# EasyEDA Pro project picobug.epro, board PCB1
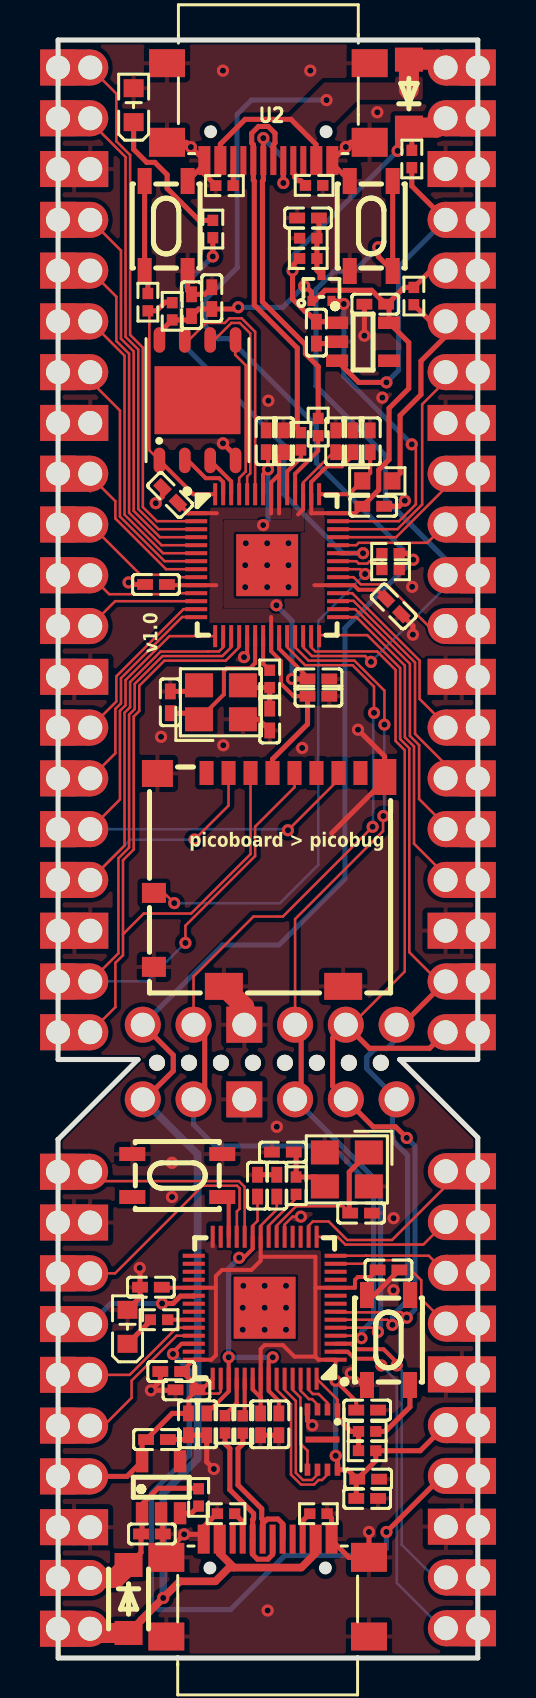
[diagram p1: board, top side]
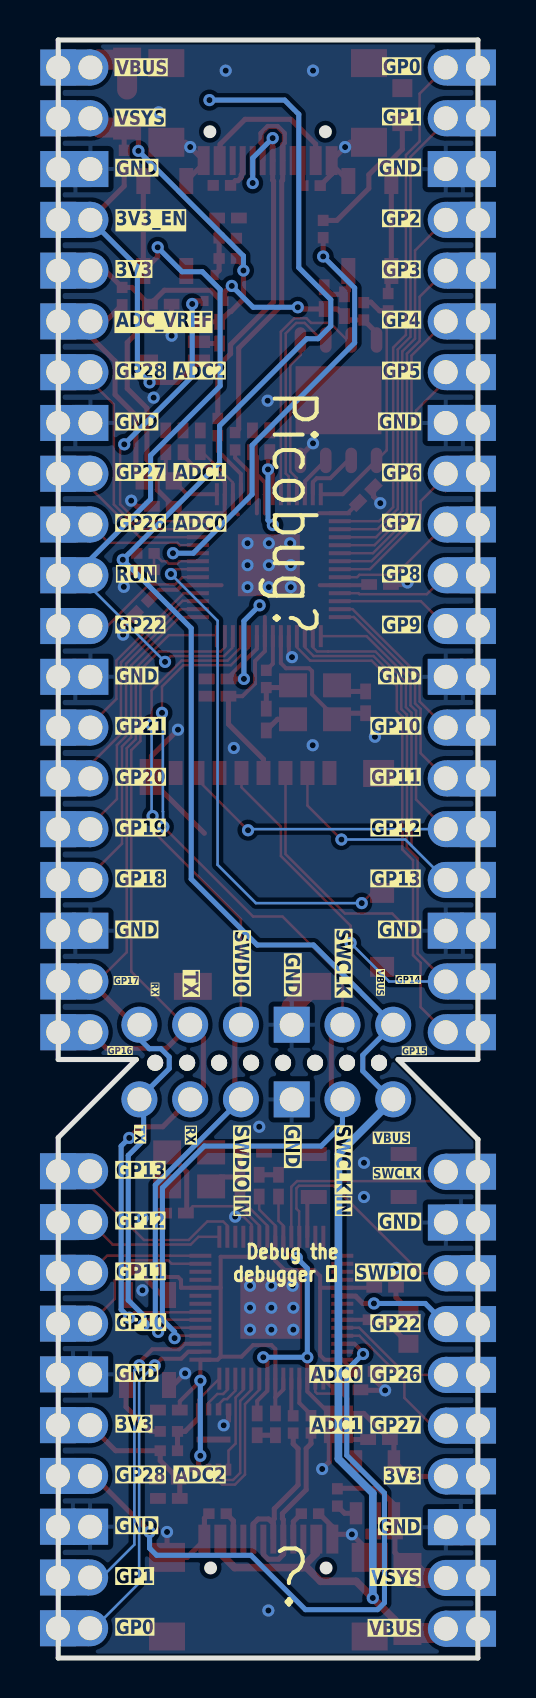
[diagram p2: board, bottom side, seen from below]

Outline 21 x 80.94 mm; copper layers: Top Layer, Bottom Layer. Coordinates in mm from the lower left corner of the outline.
Outline path: 0,80.94 21,80.94 21,29.94 17.09,29.94 21,26.03 21,0 0,0 0,25.94 0,25.94 4,29.94 0,29.94 0,80.94
Stack: Top Layer 0.035mm / Dielectric1 1.51mm FR4 er 4.5 / Bottom Layer 0.035mm

## Design rules (mm)
net D-: DP1
net D+: DP1
net DBG_D+: DP2
net DBG_D-: DP2
template: Custom Config
spacing copperThickness1oz (default): track to track 0.102, other pairs 0.152 to 0.3
spacing copperThickness2oz: track to track 0.203, other pairs 0.152 to 0.3
track width copperThickness1oz (default): min 0.127, default 0.254, max 2.54
track width copperThickness2oz: min 0.203, default 0.254, max 2.54
differential pair differentialPair (default): width min 0.127, default 0.254, max 2.54; gap min 0.152, default 0.152
via viaSize (default): diameter min 0.5, default 0.61, max 10; hole min 0.3, default 0.305, max 6.3

## Placement (name value [footprint] x y rotation side)
C1  1uF  [C0402]  12.93 66.3 90 top
C2  1uF  [C0402]  15.87 67.72 0 top
C3  1uF  [C0402]  13.89 60.87 270 top
C4  100nF  [C0402]  13.03 48.98 180 top
C5  100nF  [C0402]  10.41 60.87 270 top
C7  1uF  [C0402]  14.75 60.87 270 top
C8  100nF  [C0402]  16.79 52.6 135 top
C9  100nF  [C0402]  11.28 60.87 270 top
C10  100nF  [C0402]  13.03 48.11 180 top
C11  100nF  [C0402]  15.77 57.61 180 top
C12  100nF  [C0402]  5.61 58.17 315 top
C13  100nF  [C0402]  4.9 53.7 0 top
C16  100nF  [C0402]  7.69 68.03 270 top
C17  2.2uF  [C0402]  15.62 60.87 270 top
C18  2.2uF  [C0402]  6.68 67.67 270 top
C19  15pF  [C0402]  5.62 47.81 270 top
C20  15pF  [C0402]  10.59 46.95 90 top
C21  1nF  [C0402]  12.51 72.04 0 top
C22  100nF  [C0402]  15.47 7.98 180 top
C23  2.2uF  [C0402]  15.52 8.95 180 top
C24  1uF  [C0402]  4.95 10.93 180 top
C25  1uF  [C0402]  4.69 6.2 180 top
C26  15pF  [C0402]  11.25 25.31 0 top
C27  15pF  [C0402]  15.16 22.26 180 top
C28  100nF  [C0402]  5.66 14.33 0 top
C29  100nF  [C0402]  10.13 11.69 90 top
C30  100nF  [C0402]  4.64 18.55 0 top
C31  100nF  [C0402]  15.47 12.4 180 top
C32  100nF  [C0402]  16.53 19.41 180 top
C33  100nF  [C0402]  10.94 23.63 270 top
C34  100nF  [C0402]  9.98 23.63 270 top
C35  100nF  [C0402]  11.05 11.69 90 top
C36  1uF  [C0402]  6.52 11.69 90 top
C37  1uF  [C0402]  7.44 11.69 90 top
C38  2.2uF  [C0402]  6.42 13.42 0 top
D1  PMEG40T30ERX  [SOD-123W_L2.8-W1.8-LS3.7-RD]  17.55 78.26 90 top
D2  PMEG40T30ERX  [SOD-123W_L2.8-W1.8-LS3.7-RD]  3.53 2.95 270 top
H1  2.54-1x6P直针  [HDR-TH_6P-P2.54-V-M-1]  10.59 31.68 0 top
H2  2.54-1x6P直针  [HDR-TH_6P-P2.54-V-M-1]  10.59 27.95 0 top
H3  2.54-1*10P针  [HDR-TH_10P-P2.54-V-M-1]  20.65 12.91 180 top
H4  2.54-1*10P针  [HDR-TH_10P-P2.54-V-M-1#2]  1.39 12.45 180 top
J1  2.54-1*20P直针  [HDR-TH_20P-P2.54-V-M-1#2]  0.75 55.43 0 top
J2  2.54-1*20P直针  [HDR-TH_20P-P2.54-V-M-1]  20.09 55.48 0 top
LED1  A-SP192DGHC-C01-4T  [LED0603-FD]  3.78 77.68 270 top
LED2  A-SP192DGHC-C01-4T  [LED0603-FD]  3.48 16.57 270 top
NOREF  -  [Pad_e2738]  16.15 29.78 0 top
NOREF#2  -  [Pad_e72]  4.95 29.78 0 top
NOREF#3  -  [Pad_e1808]  8.15 29.78 0 top
NOREF#4  -  [Pad_e2392]  12.95 29.78 0 top
NOREF#5  -  [Pad_e2054]  9.75 29.78 0 top
NOREF#6  -  [Pad_e2391]  11.35 29.78 0 top
NOREF#7  -  [Pad_e1554]  6.55 29.78 0 top
NOREF#8  -  [Pad_e2393]  14.55 29.78 0 top
Q1  DMG1012T  [SOT-523-3_L1.6-W0.8-P1.00-LS1.6-BR]  13.18 68.54 270 top
R1  200Ω  [R0402]  17.8 68.13 90 top
R2  1Ω  [R0603]  15.97 58.88 0 top
R3  5.6kΩ  [R0402]  16.64 55.26 0 top
R4  10kΩ  [R0402]  16.64 54.44 180 top
R5  100kΩ  [R0402]  17.7 74.99 90 top
R6  5.1kΩ  [R0402]  12.81 73.67 0 top
R7  5.1kΩ  [R0402]  8.32 73.66 180 top
R8  27Ω  [R0402]  12.15 60.87 90 top
R9  27Ω  [R0402]  13.02 61.58 90 top
R10  200Ω  [R0402]  7.74 71.48 270 top
R11  10kΩ  [R0402]  5.71 67.37 270 top
R12  1kΩ  [R0402]  4.49 67.82 90 top
R13  1kΩ  [R0402]  10.59 48.98 90 top
R14  100kΩ  [R0402]  12.52 71.03 0 top
R15  200kΩ  [R0402]  12.52 70.01 180 top
R16  5.1kΩ  [R0402]  8.4 7.22 180 top
R17  5.1kΩ  [R0402]  13.03 7.22 0 top
R18  1kΩ  [R0402]  15.47 11.34 0 top
R19  10kΩ  [R0402]  15.47 10.37 0 top
R21  100kΩ  [R0402]  7.03 8.03 90 top
R22  1kΩ  [R0402]  11.91 23.63 270 top
R23  200Ω  [R0402]  5.05 16.92 0 top
R25  27Ω  [R0402]  8.35 11.69 270 top
R26  27Ω  [R0402]  9.24 11.68 270 top
SIM1  1040310811  [SIM-SMD_8P-1040310811]  10.57 38.94 180 top
SW1  TS-1089S-02526  [SW-SMD_4P-L4.2-W3.3-P2.15-LS5.1]  5.41 71.63 90 top
SW2  TS-1089S-02526  [SW-SMD_4P-L4.2-W3.3-P2.15-LS5.1]  15.67 71.63 270 top
SW3  TS-1089S-02526  [SW-SMD_4P-L4.2-W3.3-P2.15-LS5.1]  16.53 15.91 270 top
SW4  TS-1089S-02526  [SW-SMD_4P-L4.2-W3.3-P2.15-LS5.1]  5.97 24.14 180 top
U1  RP2040  [LQFN-56_L7.0-W7.0-P0.4-EP]  10.46 54.67 0 top
U2  GT-USB-9047A  [USB-C-SMD_GT-USB-9047A]  10.52 77.34 180 top
U3  AP2112K-3.3TRG1  [SOT-25-5_L2.9-W1.6-P0.95-LS2.8-BL]  15.26 65.84 270 top
U4  W25Q128JVPIQ  [WSON-8_L6.0-W5.0-P1.27-BL-EP]  6.98 62.92 0 top
U5  ABM8-272-T3  [CRYSTAL-SMD_4P-L3.2-W2.5-BL]  8.15 47.81 0 top
U6  GT-USB-9047A  [USB-C-SMD_GT-USB-9047A]  10.49 3.51 0 top
U8  AP2112K-3.3TRG1  [SOT-25-5_L2.9-W1.6-P0.95-LS2.8-BL]  5.15 8.54 0 top
U9  ABM8-272-T3  [CRYSTAL-SMD_4P-L3.2-W2.5-BL]  14.45 24.44 180 top
U10  RP2040  [LQFN-56_L7.0-W7.0-P0.4-EP]  10.34 17.52 180 top
U11  W25Q16JVUXIQ  [USON-8_L3.0-W2.0-P0.50-BL-EP]  13.23 10.93 180 top

## Footprints (pads in the part's own frame, mm; a bottom-side part is the same pattern mirrored in y, then rotated)
C0402
  rect 0.79x0.54 smd: 1(-0.545,0) 2(0.545,0)
CRYSTAL-SMD_4P-L3.2-W2.5-BL
  rect 1.4x1.2 smd: 1(-1.1,-0.85) 2(1.1,-0.85) 3(1.1,0.85) 4(-1.1,0.85)
HDR-TH_6P-P2.54-V-M-1
  round 1.8 hole 1.2: 1(-6.35,0) 2(-3.81,0) 4(1.27,0) 5(3.81,0) 6(6.35,0)
  rect 1.8x1.8 hole 1.2: 3(-1.27,0)
HDR-TH_10P-P2.54-V-M-1
  rect 1.8x1.8 hole 1.2: 1(-0.367,11.422) 2(-0.367,8.882) 3(-0.367,6.342) 3(1.243,6.341) 4(-0.367,3.802) 5(-0.367,1.262) 6(-0.367,-1.278) 6(1.243,-1.279) 7(-0.367,-3.818) 8(-0.367,-6.358) 9(-0.367,-8.898) 10(-0.367,-11.438)
  custom 1.613x1.801 smd far side: 1(0.383,11.421) 2(0.383,8.881) 3(0.384,6.341) 4(0.385,3.801) 5(0.384,1.261) 6(0.385,-1.279) 7(0.386,-3.819) 8(0.386,-6.359) 9(0.386,-8.899) 10(0.387,-11.439)
  custom 1.613x1.801 smd: 1(0.438,11.421) 2(0.439,8.882) 3(0.44,6.341) 4(0.44,3.801) 5(0.44,1.262) 6(0.441,-1.278) 7(0.441,-3.818) 8(0.442,-6.359) 9(0.442,-8.899) 10(0.443,-11.438)
  round 1.8 hole 1.2: 1(1.243,11.421) 2(1.243,8.881) 4(1.243,3.801) 5(1.243,1.261) 7(1.243,-3.819) 8(1.243,-6.359) 9(1.243,-8.899) 10(1.243,-11.439)
HDR-TH_10P-P2.54-V-M-1#2
  round 1.8 hole 1.2: 1(-0.211,10.988) 2(-0.211,8.448) 4(-0.211,3.368) 5(-0.211,0.828) 6(-0.211,-1.712) 7(-0.211,-4.252) 8(-0.211,-6.792) 10(-0.211,-11.872)
  custom 1.613x1.801 smd far side: 1(0.538,10.987) 2(0.539,8.447) 3(0.539,5.907) 4(0.54,3.367) 5(0.54,0.827) 6(0.541,-1.713) 7(0.541,-4.253) 8(0.542,-6.793) 9(0.542,-9.333) 10(0.542,-11.873)
  custom 1.613x1.801 smd: 1(0.594,10.988) 2(0.595,8.447) 3(0.596,5.907) 4(0.596,3.368) 5(0.596,0.828) 6(0.597,-1.712) 7(0.597,-4.253) 8(0.598,-6.793) 9(0.598,-9.332) 10(0.599,-11.873)
  rect 1.8x1.8 hole 1.2: 1(1.399,10.987) 2(1.399,8.447) 3(-0.211,5.908) 3(1.399,5.907) 4(1.399,3.367) 5(1.399,0.827) 6(1.399,-1.713) 7(1.399,-4.253) 8(1.399,-6.793) 9(-0.211,-9.332) 9(1.399,-9.333) 10(1.399,-11.873)
HDR-TH_20P-P2.54-V-M-1
  round 1.8 hole 1.2: 1(-0.703,24.087) 2(-0.703,21.547) 4(-0.703,16.467) 5(-0.703,13.927) 6(-0.703,11.387) 7(-0.703,8.847) 9(-0.703,3.767) 10(-0.703,1.227) 11(-0.703,-1.313) 12(-0.703,-3.853) 14(-0.703,-8.933) 15(-0.703,-11.473) 16(-0.703,-14.013) 17(-0.703,-16.553) 19(-0.703,-21.633) 20(-0.703,-24.173)
  custom 1.613x1.801 smd far side: 1(0.047,24.086) 2(0.048,21.546) 3(0.048,19.006) 4(0.049,16.466) 5(0.049,13.926) 6(0.05,11.386) 7(0.05,8.846) 8(0.051,6.306) 9(0.051,3.766) 10(0.051,1.226) 11(0.051,-1.314) 12(0.052,-3.854) 13(0.052,-6.394) 14(0.053,-8.934) 15(0.053,-11.474) 16(0.054,-14.014) 17(0.053,-16.554) 18(0.054,-19.094) 19(0.055,-21.634) 20(0.056,-24.174)
  custom 1.613x1.801 smd: 1(0.103,24.087) 2(0.103,21.547) 3(0.104,19.006) 4(0.104,16.466) 5(0.104,13.927) 6(0.105,11.386) 7(0.105,8.847) 8(0.106,6.306) 9(0.106,3.767) 10(0.107,1.226) 11(0.107,-1.313) 12(0.108,-3.853) 13(0.108,-6.394) 14(0.108,-8.934) 15(0.109,-11.473) 16(0.11,-14.014) 17(0.11,-16.553) 18(0.11,-19.093) 19(0.111,-21.634) 20(0.112,-24.174)
  rect 1.8x1.8 hole 1.2: 1(0.907,24.086) 2(0.907,21.546) 3(-0.703,19.007) 3(0.907,19.006) 4(0.907,16.466) 5(0.907,13.926) 6(0.907,11.386) 7(0.907,8.846) 8(-0.703,6.307) 8(0.907,6.306) 9(0.907,3.766) 10(0.907,1.226) 11(0.907,-1.314) 12(0.907,-3.854) 13(-0.703,-6.393) 13(0.907,-6.394) 14(0.907,-8.934) 15(0.907,-11.474) 16(0.907,-14.014) 17(0.907,-16.554) 18(-0.703,-19.093) 18(0.907,-19.094) 19(0.907,-21.634) 20(0.907,-24.174)
HDR-TH_20P-P2.54-V-M-1#2
  rect 1.8x1.8 hole 1.2: 1(-0.753,24.131) 2(-0.753,21.591) 3(-0.753,19.051) 3(0.857,19.05) 4(-0.753,16.511) 5(-0.753,13.971) 6(-0.753,11.431) 7(-0.753,8.891) 8(-0.753,6.351) 8(0.857,6.35) 9(-0.753,3.811) 10(-0.753,1.271) 11(-0.753,-1.269) 12(-0.753,-3.809) 13(-0.753,-6.349) 13(0.857,-6.35) 14(-0.753,-8.889) 15(-0.753,-11.429) 16(-0.753,-13.969) 17(-0.753,-16.509) 18(-0.753,-19.049) 18(0.857,-19.05) 19(-0.753,-21.589) 20(-0.753,-24.129)
  custom 1.613x1.801 smd far side: 1(-0.004,24.13) 2(-0.003,21.59) 3(-0.003,19.05) 4(-0.002,16.51) 5(-0.002,13.97) 6(-0.001,11.43) 7(-0.001,8.89) 8(0,6.35) 9(0,3.81) 10(0.001,1.27) 11(0.001,-1.27) 12(0.002,-3.81) 13(0.002,-6.35) 14(0.002,-8.89) 15(0.003,-11.43) 16(0.004,-13.97) 17(0.003,-16.51) 18(0.004,-19.05) 19(0.004,-21.59) 20(0.005,-24.13)
  custom 1.613x1.801 smd: 1(0.052,24.131) 2(0.053,21.59) 3(0.053,19.05) 4(0.054,16.511) 5(0.054,13.97) 6(0.054,11.431) 7(0.055,8.89) 8(0.056,6.351) 9(0.056,3.811) 10(0.057,1.27) 11(0.057,-1.27) 12(0.058,-3.809) 13(0.058,-6.349) 14(0.058,-8.889) 15(0.059,-11.43) 16(0.059,-13.97) 17(0.059,-16.509) 18(0.059,-19.049) 19(0.06,-21.59) 20(0.061,-24.13)
  round 1.8 hole 1.2: 1(0.857,24.13) 2(0.857,21.59) 4(0.857,16.51) 5(0.857,13.97) 6(0.857,11.43) 7(0.857,8.89) 9(0.857,3.81) 10(0.857,1.27) 11(0.857,-1.27) 12(0.857,-3.81) 14(0.857,-8.89) 15(0.857,-11.43) 16(0.857,-13.97) 17(0.857,-16.51) 19(0.857,-21.59) 20(0.857,-24.13)
LED0603-FD
  rect 0.9x1 smd: 1(-0.85,0) 2(0.85,0)
LQFN-56_L7.0-W7.0-P0.4-EP
  rect 1.1x0.2 smd: 1(-3.55,2.6) 2(-3.55,2.2) 3(-3.55,1.8) 4(-3.55,1.4) 5(-3.55,1) 6(-3.55,0.6) 7(-3.55,0.2) 8(-3.55,-0.2) 9(-3.55,-0.6) 10(-3.55,-1) 11(-3.55,-1.4) 12(-3.55,-1.8) 13(-3.55,-2.2) 14(-3.55,-2.6) 29(3.55,-2.6) 30(3.55,-2.2) 31(3.55,-1.8) 32(3.55,-1.4) 33(3.55,-1) 34(3.55,-0.6) 35(3.55,-0.2) 36(3.55,0.2) 37(3.55,0.6) 38(3.55,1) 39(3.55,1.4) 40(3.55,1.8) 41(3.55,2.2) 42(3.55,2.6)
  rect 0.2x1.1 smd: 15(-2.6,-3.55) 16(-2.2,-3.55) 17(-1.8,-3.55) 18(-1.4,-3.55) 19(-1,-3.55) 20(-0.6,-3.55) 21(-0.2,-3.55) 22(0.2,-3.55) 23(0.6,-3.55) 24(1,-3.55) 25(1.4,-3.55) 26(1.8,-3.55) 27(2.2,-3.55) 28(2.6,-3.55) 43(2.6,3.55) 44(2.2,3.55) 45(1.8,3.55) 46(1.4,3.55) 47(1,3.55) 48(0.6,3.55) 49(0.2,3.55) 50(-0.2,3.55) 51(-0.6,3.55) 52(-1,3.55) 53(-1.4,3.55) 54(-1.8,3.55) 55(-2.2,3.55) 56(-2.6,3.55)
  rect 3.1x3.1 smd: 57(0,0)
Pad_e72
  round 0.8 hole 0.8: 1(0,0)
Pad_e1554
  round 0.8 hole 0.8: 1(0,0)
Pad_e1808
  round 0.8 hole 0.8: 1(0,0)
Pad_e2054
  round 0.8 hole 0.8: 1(0,0)
Pad_e2391
  round 0.8 hole 0.8: 1(0,0)
Pad_e2392
  round 0.8 hole 0.8: 1(0,0)
Pad_e2393
  round 0.8 hole 0.8: 1(0,0)
Pad_e2738
  round 0.8 hole 0.8: 1(0,0)
R0402
  rect 0.566x0.54 smd: 1(-0.433,0) 2(0.433,0)
R0603
  rect 0.806x0.864 smd: 1(-0.753,0) 2(0.753,0)
SIM-SMD_8P-1040310811
  rect 0.7x1.2 smd: 1(3.138,-5.338) 2(2.038,-5.338) 3(0.938,-5.338) 4(-0.163,-5.338) 5(-1.262,-5.338) 6(-2.362,-5.338) 7(-3.462,-5.338) 8(-4.562,-5.338)
  rect 1.17x1.8 smd: 9(-5.772,-5.138)
  rect 1.55x1.35 smd: 10(5.598,-5.312)
  rect 1.2x1 smd: 11(5.772,0.662) 12(5.772,4.362)
  rect 1.9x1.35 smd: 13(2.272,5.338) 14(-3.697,5.338)
SOD-123W_L2.8-W1.8-LS3.7-RD
  rect 1.2x1.4 smd: 1(-1.7,0) 2(1.7,0)
SOT-25-5_L2.9-W1.6-P0.95-LS2.8-BL
  rect 0.623x1.105 smd: 1(-0.95,-1.3) 2(-0.001,-1.3) 3(0.95,-1.3) 4(0.95,1.3) 5(-0.95,1.3)
SOT-523-3_L1.6-W0.8-P1.00-LS1.6-BR
  rect 0.51x0.4 smd: 1(0.65,-0.5) 2(0.65,0.5) 3(-0.65,0)
SW-SMD_4P-L4.2-W3.3-P2.15-LS5.1
  rect 1.3x0.7 smd: 1(-2.25,1.075) 2(2.25,1.075) 3(-2.25,-1.075) 4(2.25,-1.075)
USB-C-SMD_GT-USB-9047A
  rect 1.8x1.45 smd: 12(-5.07,1.524) 13(5.07,1.524)
  rect 1.8x1.4 smd: 14(-5.07,-2.437) 15(5.07,-2.437)
  rect 0.6x1.45 smd: A1B12(-3.2,2.437) A4B9(-2.4,2.437) A9B4(2.4,2.437) A12B1(3.2,2.437)
  rect 0.3x1.45 smd: A5(-1.25,2.437) A6(-0.25,2.437) A7(0.25,2.437) A8(1.25,2.437) B5(1.75,2.437) B6(0.75,2.437) B7(-0.75,2.437) B8(-1.75,2.437)
USON-8_L3.0-W2.0-P0.50-BL-EP
  rect 0.28x0.6 smd: 1(-0.75,-1.508) 2(-0.25,-1.508) 3(0.25,-1.508) 4(0.75,-1.508) 5(0.75,1.508) 6(0.25,1.508) 7(-0.25,1.508) 8(-0.75,1.508)
  rect 1.7x0.3 smd: 9(0,0)
WSON-8_L6.0-W5.0-P1.27-BL-EP
  oval 0.581x1.276 smd: 1(-1.905,-3.013) 2(-0.635,-3.013) 3(0.635,-3.013) 4(1.905,-3.013) 5(1.905,3.013) 6(0.635,3.013) 7(-0.635,3.013) 8(-1.905,3.013)
  rect 4.3x3.4 smd: 9(0,0)

## Nets
As in the schematic.

Pads without a net: NOREF 1; NOREF#2 1; NOREF#3 1; NOREF#4 1; NOREF#5 1; NOREF#6 1; NOREF#7 1; NOREF#8 1; SIM1 1 8; SW3 1; SW4 2; U2 A8 B8; U3 4; U4 9; U6 A8 B8; U8 4; U11 9

## Via types
v1: diameter 0.61, hole 0.305, Top Layer to Bottom Layer, 94 vias
v2: diameter 0.61, hole 0.3, Top Layer to Bottom Layer, 1 via

## Routing (per net, layer and track width the routed paths; a pad name or vN(x,y) marks a point on that pad's centre or on a via; arc(x,y) is an arc through that point)
1V1: length 16.6
  Top Layer w0.127: C3.2 13.78,60.32 12.26,58.8 12.26,58.22
  Top Layer w0.2: C5.2 10.5,60.23 v1(10.5,59.46) 10.26,59.22 10.26,58.22 ; U1.23 11.06,50.49 12.47,49.08 12.47,48.98 ; 12.26,58.22 12.26,57.46 12.01,57.21
  Top Layer w0.254: 12.47,48.98 12.47,48.98 v1(11.71,48.98)
  Bottom Layer w0.254: v1(10.92,52.66) 11.71,51.88 v1(11.71,48.98) ; v1(10.5,59.46) 10.5,56.92 v2(10.26,56.67)
3V3: length 59.6
  Top Layer w0.2: C7.2 14.75,60.16 14.2,59.61 13.45,59.61 12.66,58.82 U1.44 12.67,58.21 12.67,57.26 12.68,57.27 U1.42 14.88,57.27 C11.2 ; 11.06,59.15 11.01,59.15 10.66,58.8 U1.49 10.66,57.26 ; 11.06,59.15 U1.48 11.06,57.26 ; 11.06,59.15 11.06,60.1 C9.2 ; 7.95,57.27 6.51,57.27 6,57.79 ; 10.66,52.08 U1.22 10.66,50.37 11.15,49.87 11.15,48.75 11.78,48.11 C10.2 ; 12.82,53.67 U1.33 14.81,53.67 15.04,53.44 15.95,53.44 C8.2 ; 5.29,53.75 5.38,53.67 U1.10 7.92,53.67
  Top Layer w0.254: 12.37,68.64 12.68,68.32 Q1.1 12.83,67.89 13.36,68.42 15.69,68.42 16.22,67.89 16.25,67.89 C2.2 ; J2.5 18.64,69.4 17.8,68.56 17.31,68.56 16.48,67.72 C2.2 ; C2.2 16.56,67.58 U3.5 17.55,65.81 17.55,63.51 16.56,62.52 16.56,59.95 16.04,59.43 16.04,58.43 C11.2 ; SIM1.4 10.73,44.96 12.48,46.72 C10.2 ; U4.8 5.07,66.3 R11.2 6.48,66.93 C18.2 7.03,67.48 C16.2 8.93,67.48 v1(9.01,67.57)
  Bottom Layer w0.254: v1(9.01,67.57) 11.25,67.57 v1(12.32,68.64)
3V3_EN: length 15.6
  Top Layer w0.254: v1(16.43,63.81) 15.04,63.81 U3.3 ; J2.4 17.7,73.63 R5.1
  Bottom Layer w0.254: J2.4 17.04,69.59 17.04,64.42 v1(16.43,63.81)
GND: length 59.9
  Top Layer w0.127: v1(12.15,22.08) 11.73,22.08 11.34,21.68 U10.19
  Top Layer w0.2: U1.19 9.46,50.23 v1(9.3,50.07)
  Top Layer w0.254: C1.1 13.87,65.76 U3.2 ; U8.2 5.24,7.15 C25.1 5.24,5.21 U6.12 5.42,5.3 v1(6.31,6.19) 7.05,6.19 U6.A1B12 7.29,6.57 7.94,7.22 7.97,7.22 ; C34.1 C33.1 ; LED2.1 4.1,18.04 C30.1 4.1,19.5 v1(4.09,19.51) ; 14.59,73.88 13.72,74.76 U2.A1B12 v1(14.4,75.59) 14.63,75.82 U2.12 ; v1(15.01,46.44) 16.34,45.11 SIM1.9 16.34,43.91 13.69,41.26 ; R17.2 13.69,6.99 13.69,5.9 14.55,5.04 U6.13 v1(15.56,6.31) ; C20.1 10.03,46.96 U5.2 ; C19.1 6.74,48.35 U5.4 ; C11.1 17.07,57.61 v1(17.35,57.9) ; C13.1 3.63,53.7 v1(3.53,53.8) ; C12.1 5.22,58.11 v1(4.89,57.77) ; C16.1 7.34,68.22 C18.1 6.48,68.41 SW1.3 ; C24.1 6.31,10.93 C36.1 C37.1 7.44,9.81 v1(7.79,9.46) ; 17.18,52.22 17.75,51.64 v1(17.75,51.19) ; 7.32,74.72 7.32,74.23 R7.2 ; 7.32,74.72 SW1.4 ; 7.32,74.72 U2.A12B1 v1(6.65,75.58) 6.41,75.82 U2.13 ; C2.1 v1(15.33,66.15) ; v1(12.72,11.64) 12.48,11.88 U11.4 ; U4.4 8.88,60.13 v1(8.25,60.76) ; SW3.3 15.82,18.16 C32.1 ; SW3.4 15.24,13.66 v1(14.65,14.24) ; C38.1 5.85,13.39 v1(4.64,13.39) 5.12,13.86 C28.1 ; C35.1 C29.1
  Top Layer w1: H1.3 9.32,32.58 8.3,33.6
  vias: v1(5.15,46.08) v1(5.7,24.77) v1(5.7,23.06) v1(8.25,79.41) v1(8.27,45.66) v1(9.27,18.62) v1(9.24,17.52) v1(9.24,16.42) v1(9.39,55.77) v1(9.36,54.67) v1(9.36,53.57) v1(10.34,18.62) v1(10.34,17.52) v1(10.34,16.42) v1(10.46,55.77) v1(10.46,54.67) v1(10.46,53.57) v1(10.49,2.38) v1(10.52,62.9) v1(10.94,26.58) v1(11.4,18.62) v1(11.4,17.52) v1(11.4,16.42) v1(11.53,55.77) v1(11.53,54.67) v1(11.53,53.57) v1(12.21,45.52) v1(12.62,79.41) v1(15.97,77.32) v1(16.23,63.05) v1(16.79,22) v1(16.79,18.4) v1(17.72,53.58)
VBUS: length 127
  Top Layer w0.254: H2.1 4.34,27.95 5.76,29.37 5.76,30.16 H1.1 ; 12.9,74.93 12.9,75.72 11.65,76.97 9.36,76.97 8.12,75.73 U2.A9B4 ; R3.2 17.45,55.26 v1(17.77,54.94)
  Top Layer w0.381: 8.8,4.53 8.56,4.53 7.87,3.84 6.09,3.84 v1(5.26,3) 4.17,1.92 4.17,1.9 D2.2 ; 8.8,4.53 12.17,4.53 12.89,5.24 U6.A9B4 ; 8.8,4.53 8.09,5.24 U6.A4B9
  Top Layer w1: 17.55,78.46 D1.2 19,79.96 J2.1 ; D2.2 1.82,1.25 H4.1
  Bottom Layer w0.254: v1(13.43,77.93) 9.67,77.93 8.96,77.22 8.96,69.55 7.36,67.95 7.36,66.63 8,66 8.57,66 12.93,61.64 12.93,59.78 v1(17.77,54.94) 14.35,51.52 14.35,38.97 11.05,35.67 8.23,35.67 H1.1 5.76,30.16 5.76,29.37 4.34,27.95 H2.1
  Bottom Layer w0.381: H2.1 6.98,25.2 6.98,9.96 5.26,8.24 v1(5.26,3)
ADC_VREF: length 11
  Top Layer w0.254: R2.2 17.11,59.27 17.11,62.16 18.16,63.2 18.16,64.88 19.39,66.11 J2.6 18.63,66.86 R1.1
D+: length 18.8
  Top Layer w0.254: 10.77,74.91 10.77,75.71 10.85,75.79 10.85,76.27 10.51,76.62 10.03,76.62 9.69,76.27 9.69,75.79 9.77,75.71 9.77,73.93 9.82,73.88 9.82,67.68 11.97,65.53 11.97,61.48 12.15,61.3
D-: length 19
  Top Layer w0.254: 10.27,74.91 v1(10.27,76.03) ; 11.27,74.91 v1(11.27,73.79) ; R9.2 13.02,64.61 12.38,65.25 12.38,65.7 10.22,67.85 10.22,73.88 10.27,73.93 U2.A7
  Bottom Layer w0.254: v1(11.27,73.79) 11.27,75.03 v1(10.27,76.03)
DBG_1V1: length 17.3
  Top Layer w0.127: C34.2 9.98,21.87 9.74,21.63 U10.23
  Top Layer w0.2: U10.23 9.74,20.47 9.29,20.02 v1(9.06,20.02) ; C35.2 11.05,12.86 10.54,13.37 U10.50 10.54,14.84 v1(10.74,15.04) ; v1(8.54,15.05) U10.45 8.54,13.33 C37.2
  Bottom Layer w0.254: v1(10.74,15.04) 8.54,15.04 v1(8.54,15.05) 8.54,19.49 v1(9.06,20.02)
DBG_3V3: length 62.5
  Top Layer w0.127: U10.22 10.14,21.63 10.94,22.43 C33.2 ; U10.44 8.14,13.32 8.05,13.23 7.16,13.23 C38.2
  Top Layer w0.2: 7.9,18.52 U10.33 5.22,18.52 C30.2 ; 7.9,18.52 7.9,19.11 8.2,19.41 9.67,19.41 10.14,19.88 10.14,20.07 ; 7.9,18.52 7.9,15.15 7.67,14.92 6.79,14.92 6.21,14.34 C28.2 ; 10.14,13.03 10.14,12.24 C29.2 ; 10.14,13.03 U10.49 10.14,15.46 10.33,15.65 11.25,15.65 11.83,15.07 12.87,15.07 ; 10.14,13.03 9.74,13.43 U10.48 ; U10.43 7.18,13.42 C38.2 6.52,12.97 C36.2 ; 12.87,15.07 12.87,18.52 ; 12.87,15.07 13.03,14.92 13.89,14.92 v1(13.89,13.87) 14.92,12.84 C31.2 ; 12.87,18.52 U10.10 14.85,18.52 14.85,18.91 15,19.06 15.63,19.06 C32.2 ; 12.87,18.52 12.87,20.07 10.14,20.07 ; 10.14,20.07 U10.22
  Top Layer w0.254: C23.2 14.92,8.9 C22.2 ; C23.2 14.5,9.42 U11.8 13.98,10.03 v1(13.89,10.12) ; C23.2 15.9,9.87 R19.2 18.12,10.37 H3.5 ; C36.2 5.71,12.24 C24.2 4.2,10.73 U8.5 3.45,9.08 H4.4 ; C38.2 6.97,13.57 C28.2
  Bottom Layer w0.254: v1(13.89,10.12) 13.89,13.87 v1(13.89,13.87)
DBG_3V3_EN: length 1.1
  Top Layer w0.254: 7.03,7.6 6.67,7.24 U8.3
DBG_D+: length 7.9
  Top Layer w0.254: R26.2 9.24,10.71 9,10.47 9,8.66 10.19,7.47 10.19,6.97 10.24,6.93 10.24,6.72 ; U6.A6 10.24,6.72 ; 10.24,6.72 10.47,6.95 11,6.95 11.25,6.71 11.25,5.96 U6.B6
DBG_D-: length 8.7
  Top Layer w0.254: U6.A7 10.74,5.18 10.5,4.94 9.97,4.94 9.72,5.19 9.72,5.94 U6.B7 9.74,6.93 9.78,6.97 9.78,7.23 8.59,8.42 8.59,10.48 8.35,10.72 R25.2
DBG_GPIO0: length 17.2
  Top Layer w0.2: v1(16.17,14.64) 15.84,14.97 14.85,14.97 14.49,15.32 U10.2
  Bottom Layer w0.127: H3.1 19.22,1.49 16.95,3.75 16.95,13.86 v1(16.17,14.64)
DBG_GPIO1: length 15.6
  Top Layer w0.2: U10.3 14.67,15.72 14.95,15.45 16.29,15.45 16.94,14.79 v1(16.94,14.64)
  Bottom Layer w0.127: v1(16.94,14.64) 17.19,14.39 17.19,5.67 18.83,4.03 H3.2
DBG_GPIO10: length 7.7
  Top Layer w0.127: H3.7 18.17,17.96 18.17,18.9 17.69,19.38 17.69,19.77 17.56,19.9 15.5,19.9 15.33,19.72 U10.13
DBG_GPIO11: length 5.9
  Top Layer w0.127: U10.14 15.4,20.12 15.41,20.13 17.66,20.13 17.66,20.12 18.55,20.12 H3.8
DBG_GPIO12: length 7.1
  Top Layer w0.127: H3.9 18.28,20.68 14.37,20.68 13.98,21.07 U10.15
DBG_GPIO13: length 9.8
  Top Layer w0.127: U10.16 12.54,21.63 12.75,21.84 13.54,21.84 14.47,20.91 16.71,20.91 19.4,23.61 H3.10
DBG_GPIO22: length 5.8
  Top Layer w0.254: v1(5.2,17.74) 5.75,17.74 6.12,18.1 6.77,18.1 U10.34
  Bottom Layer w0.254: v1(5.2,17.74) 2.64,17.74 H4.7
DBG_GPIO25: length 1.3
  Top Layer w0.2: 6.79,16.92 5.48,16.92
DBG_GPIO26_ADC0: length 6.2
  Top Layer w0.127: H4.6 3.58,14.16 5.94,16.52 U10.38
DBG_GPIO27_ADC1: length 7.5
  Top Layer w0.127: U10.39 5.93,16.12 3.68,13.88 3.68,13.02 2.29,11.62 H4.5
DBG_GPIO28_ADC2: length 33
  Top Layer w0.2: U10.40 6.18,15.72 5.71,15.25 5.71,15.25
  Top Layer w0.254: H3.4 19.23,9.11 v1(16.43,6.31)
  Bottom Layer w0.254: v1(5.75,15.21) 6.56,14.4 6.56,10.14 4.68,8.25 4.68,2.76 5.02,2.42 8.63,2.42 11.35,5.14 16.07,5.14 16.43,5.49 v1(16.43,6.31)
DBG_QSPI_SCLK: length 6.5
  Top Layer w0.127: U11.6 12.98,9.18 12.71,8.91 12.25,8.91 11.9,9.26 11.9,12.86 11.34,13.42 U10.52
DBG_QSPI_SD0: length 4.9
  Top Layer w0.127: U11.5 12.48,10.37 12.12,10.73 12.12,13.03 11.74,13.42 U10.53
DBG_QSPI_SD1: length 2.1
  Top Layer w0.127: U11.2 13.48,12.77 13.04,13.21 12.75,13.21 12.54,13.42 U10.55
DBG_QSPI_SD2: length 2
  Top Layer w0.127: U11.3 12.98,12.68 12.71,12.95 12.55,12.95 12.14,13.37 U10.54
DBG_QSPI_SD3: length 7.6
  Top Layer w0.127: U10.51 10.94,13.42 11.66,12.7 11.66,9.18 12.16,8.68 12.8,8.68 13.03,8.91 13.21,8.91 13.48,9.18 U11.7
DBG_QSPI_SS: length 4.7
  Top Layer w0.127: U10.56 13.98,12.93 U11.1
  Top Layer w0.254: R19.1 R18.1 14.65,11.34 13.98,12.01 U11.1
DBG_RUN: length 2.1
  Top Layer w0.2: U10.26 8.54,22.74 SW4.1
DBG_SWCLK: length 10.5
  Top Layer w0.127: H4.10 2.07,23.86 9.05,23.86 9.34,23.57 U10.24
DBG_SWD: length 11.8
  Top Layer w0.127: 8.95,21.08 8.95,22.34 9.08,22.48 9.08,23.5 8.95,23.63 7.23,23.63 2.85,19.24 H4.8
DBG_VSYS: length 8.7
  Top Layer w0.254: R21.2 7.01,8.49 5,8.49 4.2,7.69 U8.1 4.2,6.26 C25.2 4.15,5.28 D2.1
  Top Layer w1: H4.2 2.88,4 D2.1
DBG_XIN: length 8.2
  Top Layer w0.127: U10.20 10.94,21.63 11.91,22.6 14.27,22.6 14.57,22.3
  Top Layer w0.254: C27.2 14.57,22.3 14.57,24.31 U9.1
DBG_XOUT: length 2.7
  Top Layer w0.127: U10.21 10.54,21.63 11.91,23 R22.2
GPIO0: length 26
  Top Layer w0.127: U1.2 4.95,56.87 4.24,57.57 4.24,65.55 3.6,66.19 3.6,75.18 2.92,75.87 2.92,78.26 J1.1
GPIO1: length 23.9
  Top Layer w0.127: J1.2 1.61,76.85 3.38,75.09 3.38,66.09 4.01,65.46 4.01,57.48 5.02,56.47 U1.3
GPIO2: length 19.1
  Top Layer w0.127: J1.4 3.15,70.41 3.15,66 3.78,65.36 3.78,57.38 5.1,56.07 U1.4
GPIO3: length 16.9
  Top Layer w0.127: J1.5 2.92,68.1 2.92,65.88 3.55,65.24 3.55,57.29 5.17,55.67 U1.5
GPIO4: length 15.4
  Top Layer w0.127: 1.23,66.36 1.23,66.48 J1.6 3.32,65.15 3.32,57.19 5.25,55.27 U1.6
GPIO5: length 12.6
  Top Layer w0.127: J1.7 1.61,63.89 3.1,62.4 3.1,57.1 5.33,54.87 U1.7
GPIO6: length 8.6
  Top Layer w0.127: U1.8 5.4,54.47 2.87,57 2.87,57.87 1.61,59.12 ; 1.61,58.36 1.61,59.12 ; 1.61,59.12 J1.9
GPIO7: length 6.4
  Top Layer w0.127: U1.9 6.05,54.07 5.93,54.19 4.13,54.19 J1.10
GPIO8: length 5.7
  Top Layer w0.127: J1.11 2.56,53.22 5.93,53.22 5.98,53.27 U1.11
GPIO9: length 5.8
  Top Layer w0.127: U1.12 2.85,52.87 J1.12
GPIO10: length 8.5
  Top Layer w0.127: U1.13 6.27,52.47 2.92,49.11 2.92,47.85 J1.14
GPIO11: length 10.7
  Top Layer w0.127: U1.14 6.9,52.08 6.21,52.08 3.15,49.02 3.15,47.76 2.87,47.48 2.87,45.26 J1.15
GPIO12: length 27.4
  Top Layer w0.127: SIM1.7 14.03,43.94 v1(11.5,41.41) ; J1.16 3.1,42.95 3.1,47.38 3.38,47.66 3.38,48.92 5.57,51.12 7.86,51.12
  Bottom Layer w0.127: J1.16 11.45,41.46 v1(11.5,41.41)
GPIO13: length 26.8
  Top Layer w0.127: 8.26,51.12 8.26,50.56 8.05,50.35 7.5,50.35 7.49,50.35 5.13,50.35 3.6,48.83 3.6,47.57 3.32,47.29 3.32,40.64 J1.17 ; SIM1.2 8.53,42.64 v1(6.83,40.94)
  Bottom Layer w0.127: J1.17 3.63,40.94 v1(6.83,40.94)
GPIO14: length 38.3
  Top Layer w0.127: J1.19 3.02,35.25 3.02,40.01 3.55,40.54 3.55,47.19 3.83,47.47 3.83,48.73 5.22,50.12 8.22,50.12 8.66,50.56 U1.17 ; v1(6.37,35.77) 6.37,36.63 9.86,40.12 9.86,41.59 11.83,43.56 SIM1.5
  Bottom Layer w0.127: v1(6.37,35.77) 4.44,33.84 J1.19
GPIO15: length 36.8
  Top Layer w0.127: 3.25,36.2 3.25,39.91 3.78,40.45 3.78,47.1 4.06,47.38 4.06,48.64 5.32,49.89 8.39,49.89 9.06,50.56 U1.18 ; 3.25,36.2 3.25,35.16 2.87,34.78 2.87,32.56 J1.20 ; 3.25,36.2 4.29,37.24 6.66,37.24 9.63,40.22 SIM1.3
GPIO16: length 51.4
  Top Layer w0.127: U10.7 13.92,17.29 17.18,17.29 v1(17.45,17.02) ; 14.45,31.63 14.55,31.73 14.74,31.73 17.34,34.34 17.34,45.42 16.89,45.87 16.89,49.43 15.96,50.35 12.87,50.35 12.66,50.56 U1.27
  Top Layer w0.254: J2.20 18.59,30.5 15.58,30.5 14.45,31.63 ; v1(17.45,26.02) 16.89,26.58 15.77,26.58 H2.5 13.74,28.61 13.74,31.02 H1.5
  Bottom Layer w0.254: v1(17.45,26.02) 17.85,25.61 17.85,17.43 v1(17.45,17.02)
GPIO17: length 45.2
  Top Layer w0.127: v1(16.73,16.67) 16.47,16.92 13.89,16.92 ; U1.28 13.11,51.17 15.47,51.17 17.12,49.52 17.12,45.97 17.57,45.51 17.57,35.31 19.03,33.84 J2.19
  Top Layer w0.254: H1.6 17.23,31.68 J2.19
  Bottom Layer w0.254: H1.6 16.94,30.98 16.44,30.48 15.86,30.48 15.45,30.07 15.45,29.48 16.94,27.99 H2.6 16.73,27.73 16.73,25.91 17.5,25.14 17.5,17.9 16.73,17.13 v1(16.73,16.67)
GPIO18: length 15.9
  Top Layer w0.127: J2.17 19.39,39.15 17.81,40.74 17.81,45.6 17.35,46.06 17.35,49.65 14.93,52.07 U1.29
GPIO19: length 13.7
  Top Layer w0.127: J2.16 19.34,41.51 19.34,41.69 18.06,42.97 18.06,45.67 17.61,46.13 17.61,49.73 14.87,52.47 U1.30
GPIO20: length 11.6
  Top Layer w0.127: U1.31 14.03,52.89 14.78,52.89 17.86,49.8 17.86,46.23 19.34,44.75 19.34,44.05 J2.15
GPIO21: length 9.4
  Top Layer w0.127: J2.14 19.29,46.54 19.09,46.75 19.09,46.98 18.09,47.97 18.09,49.9 14.72,53.27 U1.32
GPIO22: length 6.4
  Top Layer w0.127: U1.34 14.78,54.07 15.15,53.71 16.45,53.71 18.53,51.62 J2.12
GPIO23: length 26.2
  Top Layer w0.127: 4.8,38.27 5.3,38.27 v1(5.81,37.76) ; U1.35 15.12,54.47 v1(15.36,54.23)
  Bottom Layer w0.127: v1(15.36,54.23) 13.03,51.89 13.03,39.68 11.11,37.76 v1(5.81,37.76)
GPIO24: length 3.3
  Top Layer w0.127: R4.2 R3.1 15.82,54.87 15.6,54.87 15.47,54.75 15.04,54.75 14.92,54.87 U1.36
GPIO25: length 22
  Top Layer w0.2: U1.37 v1(15.26,55.27)
  Top Layer w0.254: v1(7.74,70.11) R10.2
  Bottom Layer w0.254: v1(7.74,70.11) 6.17,68.54 6.17,65.79 11.3,60.66 11.3,58.21 14.24,55.27 v1(15.26,55.27)
GPIO26_ADC0: length 5.8
  Top Layer w0.127: U1.38 14.92,55.67 15.04,55.79 18.47,55.79 J2.10
GPIO27_ADC1: length 7.1
  Top Layer w0.127: U1.39 16.92,56.07 19.39,58.54 J2.9
GPIO28_ADC2: length 11.8
  Top Layer w0.127: J2.7 19.39,63.89 18.22,62.72 18.22,57.7 16.98,56.47 U1.40
GPIO29_ADC3: length 16.4
  Top Layer w0.127: U1.41 17.06,56.87 17.9,57.71 17.9,60.51 v1(17.7,60.71)
  Top Layer w0.254: v1(14.3,67.73) 14.15,67.89 Q1.2
  Bottom Layer w0.254: v1(17.7,60.71) 14.3,64.11 v1(14.3,67.73)
QSPI_SCLK: length 10.7
  Top Layer w0.127: U4.6 7.82,65.93 8.67,66.79 9.09,66.79 9.62,66.26 9.62,59.26 9.46,59.1 U1.52
QSPI_SD0: length 8.1
  Top Layer w0.127: U4.5 8.86,65.91 8.86,65.19 9.39,64.67 9.39,59.35 9.06,59.03 U1.53
QSPI_SD1: length 3
  Top Layer w0.2: 8.26,58.22 8.26,58.82 8.07,59.02 7.39,59.02 6.5,59.91 U4.2
QSPI_SD2: length 2.1
  Top Layer w0.2: U1.54 8.66,58.86 U4.3
QSPI_SD3: length 12.4
  Top Layer w0.127: 9.86,58.22 9.86,66.34 9.19,67.02 8.58,67.02 8.35,66.79 7.4,66.79 6.55,65.93 U4.7
QSPI_SS: length 12.6
  Top Layer w0.127: U4.1 4.57,60.42 4.57,67.32 R12.1
  Top Layer w0.2: 7.86,58.22 6.76,58.22 U4.1
  Top Layer w0.254: R11.1 5.69,67.82 5.36,67.82 4.92,67.39 R12.1
RUN: length 37.1
  Top Layer w0.127: 12.26,51.12 12.29,51.08 12.29,50.53 12.7,50.12 15.37,50.12 v1(15.66,49.83)
  Top Layer w0.254: v1(16.02,70.57) 16.02,70.1 SW2.2 SW2.1
  Bottom Layer w0.127: v1(15.66,49.83) 19.39,53.57 J2.11
  Bottom Layer w0.254: J2.11 19.39,54.96 16.38,57.97 16.38,60.15 12.9,63.63 12.9,68.46 13.79,69.35 14.8,69.35 v1(16.02,70.57)
SWCLK: length 52.1
  Top Layer w0.127: H1.2 6.78,34.09 9.78,37.09 11.25,37.09 v1(15.74,41.58) ; v1(15.81,47.28) 15.81,48.59 14.73,49.67 12.36,49.67 11.46,50.56 U1.24 ; U10.4 15.06,16.12 v1(15.18,16)
  Top Layer w0.254: H1.2 7.34,31.12 7.34,28.51 H2.2
  Bottom Layer w0.127: v1(15.74,41.58) 15.76,41.61 15.76,41.9 15.76,41.9 15.76,42.34 15.76,42.34 15.76,47.24 v1(15.81,47.28)
  Bottom Layer w0.254: v1(15.18,16) 15.18,16.32 15.79,16.92 15.79,23.52 13.69,25.61 7.84,25.61 6.78,26.68 H2.2
SWD: length 44.1
  Top Layer w0.127: H1.4 11.86,36.96 16.26,41.37 16.26,42.1 v1(16.28,42.12) ; U10.5 15.79,16.52 v1(16,16.31) ; v1(16.33,46.69) 16.33,48.39 14.83,49.89 12.53,49.89 11.86,50.56 11.86,51.12
  Top Layer w0.254: H2.4 12.16,28.25 12.16,31.38 H1.4
  Bottom Layer w0.127: v1(16.28,42.12) 16.33,42.17 v1(16.33,46.69)
  Bottom Layer w0.254: H2.4 16.14,23.66 16.14,16.45 v1(16,16.31)
VSYS: length 17.7
  Top Layer w0.254: v1(16.99,75.39) 16.99,75.99 D1.1 17.7,76.41 R5.2 ; U3.1 13.91,66.85 C1.2 12.42,67.35 12.36,67.35 11.73,67.98 11.73,69.66 R15.2
  Top Layer w1: D1.1 18.92,76.56 J2.2
  Bottom Layer w0.254: v1(11.73,69.41) 11.73,70.14 v1(16.99,75.39)
XIN: length 7.6
  Top Layer w0.2: U5.1 8.3,48.21 8.3,49.36 8.45,49.51 9.6,49.51 9.86,49.77 9.86,51.12
  Top Layer w0.254: U5.1 6.75,47.26 C19.2
XOUT: length 1.8
  Top Layer w0.2: 10.59,49.41 10.26,49.74 10.26,51.12
$1N3759: length 1.3
  Top Layer w0.254: R7.1 8.77,73.67 8.77,74.91
$1N3763: length 1.6
  Top Layer w0.254: R6.1 12.14,73.9 12,73.9 11.84,74.07 11.84,74.2 11.77,74.28 11.77,74.91
$1N4537: length 2.5
  Top Layer w0.2: R8.1 12.15,60.04 11.46,59.35 U1.47
$1N4543: length 3.4
  Top Layer w0.2: R9.1 13.02,60.39 11.86,59.24 11.86,58.22
$1N4909: length 4
  Top Layer w0.2: U1.43 14.55,58.22 R2.1 15.62,59.28 C17.2
$1N6487: length 7.2
  Top Layer w0.254: R10.1 7.06,71.92 5.46,73.51 5.46,74.2 4.84,74.82 4.44,74.82 3.78,75.47 LED1.2
$1N8537: length 5.7
  Top Layer w0.254: R12.2 4.49,69.22 SW1.1 SW1.2
$1N9518: length 2.4
  Top Layer w0.254: U5.3 9.36,48.55 R13.1 C20.2
$1N10213: length 3
  Top Layer w0.254: 13.18,69.19 12.95,69.41 R15.1 R14.2 13.05,71.12 C21.2
$1N19566: length 1.4
  Top Layer w0.254: U6.B5 12.24,6.86 R17.1
$1N19567: length 1.4
  Top Layer w0.254: U6.A5 9.24,6.82 R16.1
$1N22078: length 2.9
  Top Layer w0.254: 13.35,23.59 12.88,24.06 R22.1 11.91,25.19 C26.2
$1N22172: length 1.7
  Top Layer w0.254: R23.1 4.62,16.86 LED2.2
$1N22974: length 1.9
  Top Layer w0.2: U10.47 9.34,12.21 R26.1
$1N22975: length 2.1
  Top Layer w0.2: R25.1 8.35,12.17 8.94,12.76 U10.46
$1N26122: length 3.3
  Top Layer w0.254: R18.2 16.38,11.34 17.61,12.56 SW3.2

## Copper pours and planes (outline as drawn; the poured copper is in the pictures)
1V1 on Top Layer: 11.51,57.7 12.45,57.7 12.45,56.23 8.91,56.23 8.91,53.14 8.88,53.11 11.32,53.11 11.32,52.44 11.28,52.4 8.12,52.4 8.12,57.09 11.51,57.09
3V3 on Top Layer: 11.56,57.7 11.56,57.06 8.15,57.06 8.15,52.4 11.33,52.4 11.33,53.12 12.01,53.12 12.01,56.22 12.45,56.22 12.45,57.7 12.45,57.7 13.49,57.7 13.49,51.63 7.41,51.63 7.41,57.7
GND on Top Layer: 14.72,53.27 18.6,49.39 21,49.39 21,51.62 19.39,51.62 19.39,51.62 18.53,51.62 16.45,53.71 15.16,53.71
GND on Top Layer: 0,80.94 21,80.94 21,60.43 0,60.43
GND on Top Layer: 0,51.71 1.52,51.71 1.61,51.62 2.85,52.87 7.21,52.87 7.24,52.89 7.24,50.51 7.08,50.35 15.96,50.35 15.96,50.35 20.85,50.35 21,50.2 21,20.69 0,20.69
GND on Top Layer: 7.41,20.89 7.41,14.66 7.37,14.62 13.28,14.62 13.28,20.89 21,20.89 21,0 0,0 0,20.89
GND on Top Layer: 16.63,55.79 16.63,53.53 18.53,51.62 21.05,51.62 21,51.67 21,55.95 18.89,55.95 18.76,56.08 18.47,55.79
GND on Bottom Layer: 0,80.94 21,80.94 21,-0.07 0,-0.07
VBUS on Top Layer: 18.25,80.94 18.25,77.95 15,77.95 12.75,75.7 11.48,76.97 13.32,78.82 16.86,78.82 16.86,80.94 16.9,80.94
DBG_3V3 on Top Layer: 10.13,20.53 7.39,20.53 7.39,14.59 13.23,14.59 13.23,20.54 10.15,20.54

## Text on the board
Bottom Silkscreen Layer: VBUS | RX | GP17 | GP16 | GP15 | GP14 | TX | SWCLK | ADC2 | ADC1 | ADC0 | GND | ADC_VREF | GP28 | RUN | GP22 | GP19 | GP18 | GP13 | GP12 | GP11 | GP10 | 3V3 | GP1 | GP0 | VSYS | 3V3_EN | GP27 | GP21 | GP26 | GP20 | GP3 | GP6 | GP2 | GP9 | SWDIO | GP4 | GP7 | GP5 | GP8 | Debug the / debugger ➡️ | IN | Picobug🪲 | 🪲
Top Silkscreen Layer: picoboard > picobug | v1.0
